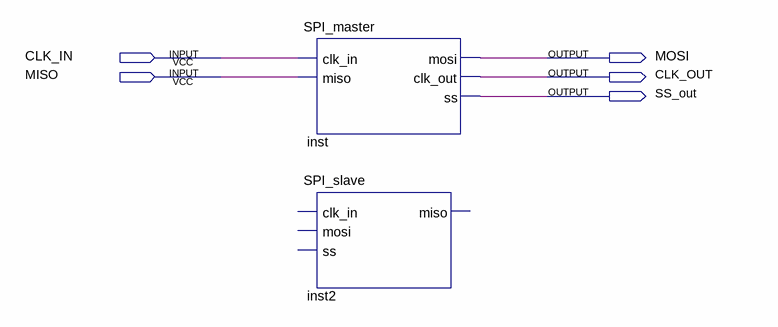
[diagram p0: schematic sheet]
// Quartus schematic SPI.bdf as structural Verilog: 2 symbols, 5 pins
module SPI (
  input  CLK_IN,
  input  MISO,
  output MOSI,
  output CLK_OUT,
  output SS_out
);

  SPI_master inst (.clk_in(CLK_IN), .miso(MISO), .mosi(MOSI), .clk_out(CLK_OUT), .ss(SS_out));
  SPI_slave inst2 ();  // open: clk_in, mosi, ss, miso
endmodule
